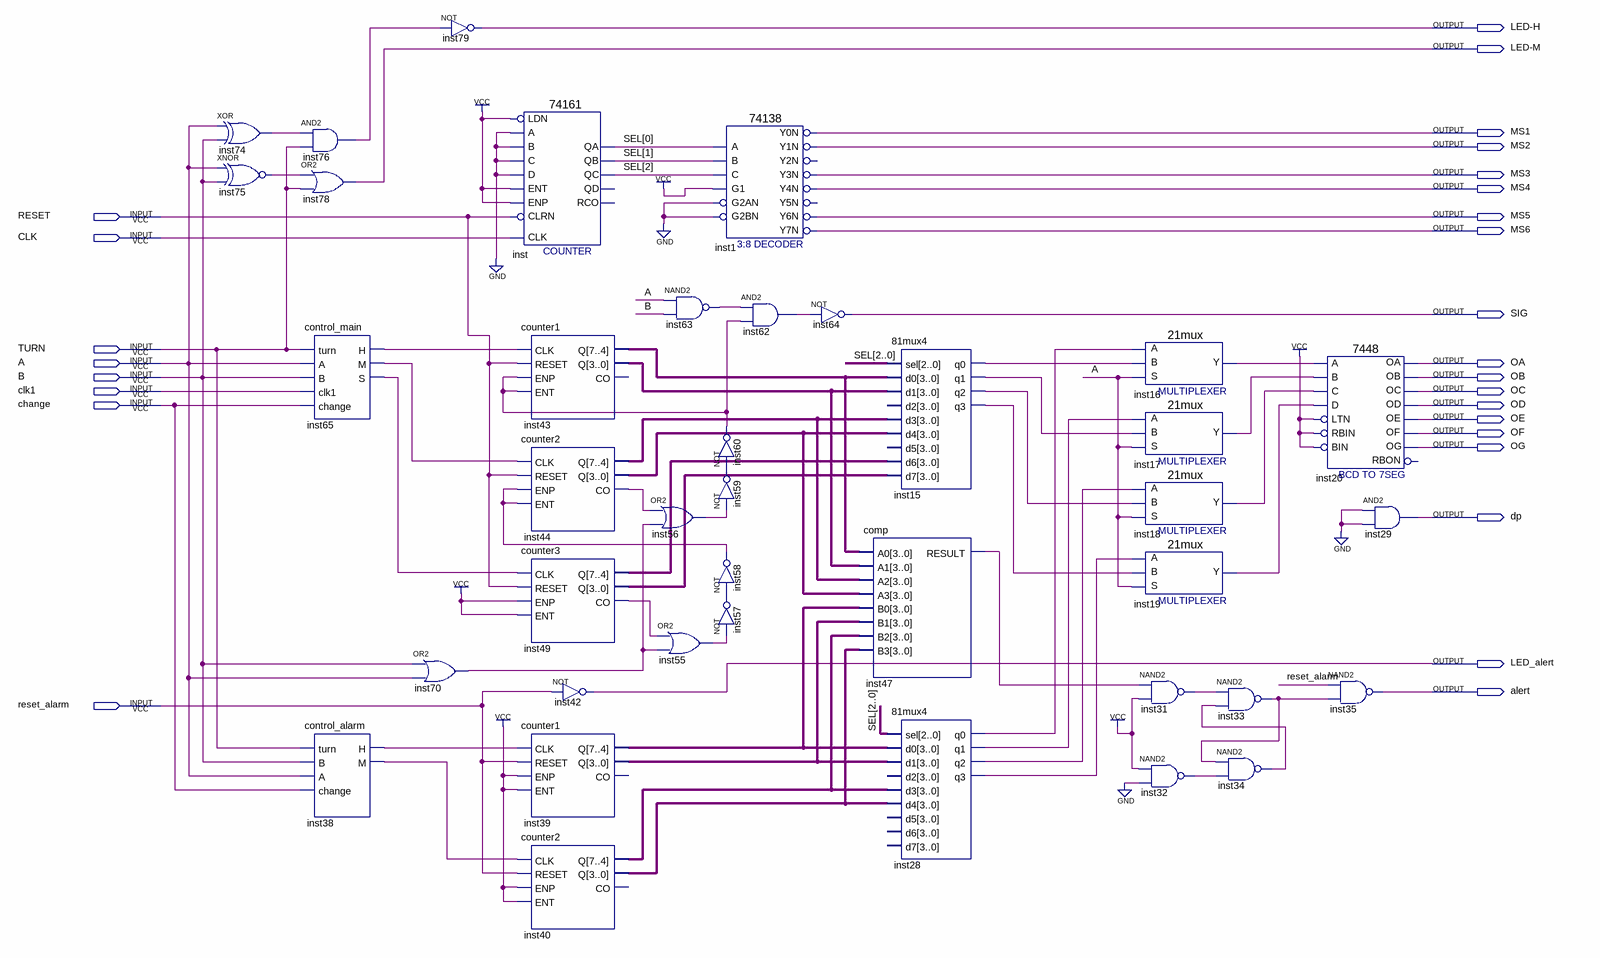
[diagram p0: schematic sheet]
// Quartus schematic digital_clock.bdf as structural Verilog: 39 symbols, 27 pins
module digital_clock (
  input  RESET,
  input  CLK,
  input  TURN,
  input  A,
  input  B,
  input  clk1,
  input  change,
  input  reset_alarm,
  output \LED-H ,
  output \LED-M ,
  output MS1,
  output MS2,
  output MS3,
  output MS4,
  output MS5,
  output MS6,
  output SIG,
  output OA,
  output OB,
  output OC,
  output OD,
  output OE,
  output OF,
  output OG,
  output dp,
  output LED_alert,
  output alert
);

  wire inst15_q0, inst15_q1, inst15_q2, inst15_q3, inst16_y, inst17_y, inst18_y, inst19_y, inst28_q0,
       inst28_q1, inst28_q2, inst28_q3, inst31_out, inst32_out, inst33_out, inst34_out, inst38_h, inst38_m,
       inst44_co, inst47_result, inst49_co, inst55_out, inst56_out, inst57_out, inst58_out, inst59_out,
       inst60_out, inst62_out, inst63_out, inst65_h, inst65_m, inst65_s, inst70_out, inst74_out, inst75_out,
       inst76_out;
  wire [2:0] SEL;
  wire [3:0] inst39_q, inst39_q_2, inst40_q, inst40_q_2, inst43_q, inst43_q_2, inst44_q, inst44_q_2,
       inst49_q, inst49_q_2;

  xor inst74 (inst74_out, A, B);
  xnor inst75 (inst75_out, A, B);
  and inst76 (inst76_out, inst74_out, TURN);
  or inst78 (\LED-M , inst75_out, TURN);
  control_main inst65 (
    .turn(TURN), .A(A), .B(B), .clk1(clk1), .change(change), .H(inst65_h), .M(inst65_m), .S(inst65_s));
  control_alarm inst38 (.turn(TURN), .B(B), .A(A), .change(change), .H(inst38_h), .M(inst38_m));
  not inst79 (\LED-H , inst76_out);
  or inst70 (inst70_out, B, A);
  \74161  inst (
    .CLRN(RESET), .CLK(CLK), .ENP(1'b1), .LDN(1'b1), .A(1'b0), .D(1'b0), .ENT(1'b1), .B(1'b0), .C(1'b0),
    .QC(SEL[2]), .QB(SEL[1]), .QA(SEL[0]));  // open: QD, RCO
  counter1 inst43 (
    .CLK(inst65_h), .RESET(RESET), .ENP(inst60_out), .ENT(inst60_out), .Q({inst43_q, inst43_q_2}));  // open: CO
  counter2 inst44 (
    .CLK(inst65_m), .RESET(RESET), .ENP(inst58_out), .ENT(inst58_out), .Q({inst44_q, inst44_q_2}),
    .CO(inst44_co));
  counter3 inst49 (.CLK(inst65_s), .RESET(RESET), .ENP(1'b1), .ENT(1'b1), .Q({inst49_q, inst49_q_2}), .CO(inst49_co));
  not inst42 (LED_alert, reset_alarm);
  counter1 inst39 (
    .CLK(inst38_h), .RESET(reset_alarm), .ENP(1'b1), .ENT(1'b1), .Q({inst39_q, inst39_q_2}));  // open: CO
  counter2 inst40 (
    .CLK(inst38_m), .RESET(reset_alarm), .ENP(1'b1), .ENT(1'b1), .Q({inst40_q, inst40_q_2}));  // open: CO
  nand inst63 (inst63_out, A, B);
  or inst56 (inst56_out, inst44_co, inst70_out);
  or inst55 (inst55_out, inst49_co, inst70_out);
  \74138  inst1 (
    .A(SEL[0]), .B(SEL[1]), .G1(1'b1), .C(SEL[2]), .G2AN(1'b0), .G2BN(1'b0), .Y0N(MS1), .Y1N(MS2), .Y3N(MS3),
    .Y4N(MS4), .Y6N(MS5), .Y7N(MS6));  // open: Y2N, Y5N
  not inst60 (inst60_out, inst59_out);
  not inst59 (inst59_out, inst56_out);
  not inst58 (inst58_out, inst57_out);
  not inst57 (inst57_out, inst55_out);
  and inst62 (inst62_out, inst63_out, inst60_out);
  not inst64 (SIG, inst62_out);
  \81mux4  inst15 (
    .sel(SEL), .d0(inst43_q), .d1(inst43_q_2), .d3(inst44_q), .d4(inst44_q_2), .d6(inst49_q),
    .d7(inst49_q_2), .q0(inst15_q0), .q1(inst15_q1), .q2(inst15_q2), .q3(inst15_q3));  // open: d2, d5
  comp inst47 (
    .A0(inst43_q), .A1(inst43_q_2), .A2(inst44_q), .A3(inst44_q_2), .B0(inst39_q), .B1(inst39_q_2),
    .B2(inst40_q), .B3(inst40_q_2), .RESULT(inst47_result));
  \81mux4  inst28 (
    .sel(SEL), .d0(inst39_q), .d1(inst39_q_2), .d3(inst40_q), .d4(inst40_q_2), .q0(inst28_q0),
    .q1(inst28_q1), .q2(inst28_q2), .q3(inst28_q3));  // open: d2, d5, d6, d7
  \21mux  inst16 (.S(A), .B(inst15_q0), .A(inst28_q0), .Y(inst16_y));
  \21mux  inst17 (.S(A), .B(inst15_q1), .A(inst28_q1), .Y(inst17_y));
  \21mux  inst18 (.S(A), .B(inst15_q2), .A(inst28_q2), .Y(inst18_y));
  \21mux  inst19 (.S(A), .B(inst15_q3), .A(inst28_q3), .Y(inst19_y));
  nand inst31 (inst31_out, inst47_result, 1'b1);
  nand inst32 (inst32_out, 1'b1, 1'b0);
  nand inst33 (inst33_out, inst31_out, inst34_out);
  nand inst34 (inst34_out, inst33_out, inst32_out);
  \7448  inst20 (
    .A(inst16_y), .C(inst18_y), .D(inst19_y), .B(inst17_y), .RBIN(1'b1), .BIN(1'b1), .LTN(1'b1), .OC(OC),
    .OE(OE), .OD(OD), .OF(OF), .OG(OG), .OB(OB), .OA(OA));  // open: RBON
  nand inst35 (alert, reset_alarm, inst33_out);
  and inst29 (dp, 1'b0, 1'b0);
endmodule
